# Altium schematic sheet STM32F407VGT6TR 100P MCU.SchDoc
size 381 x 254 mm
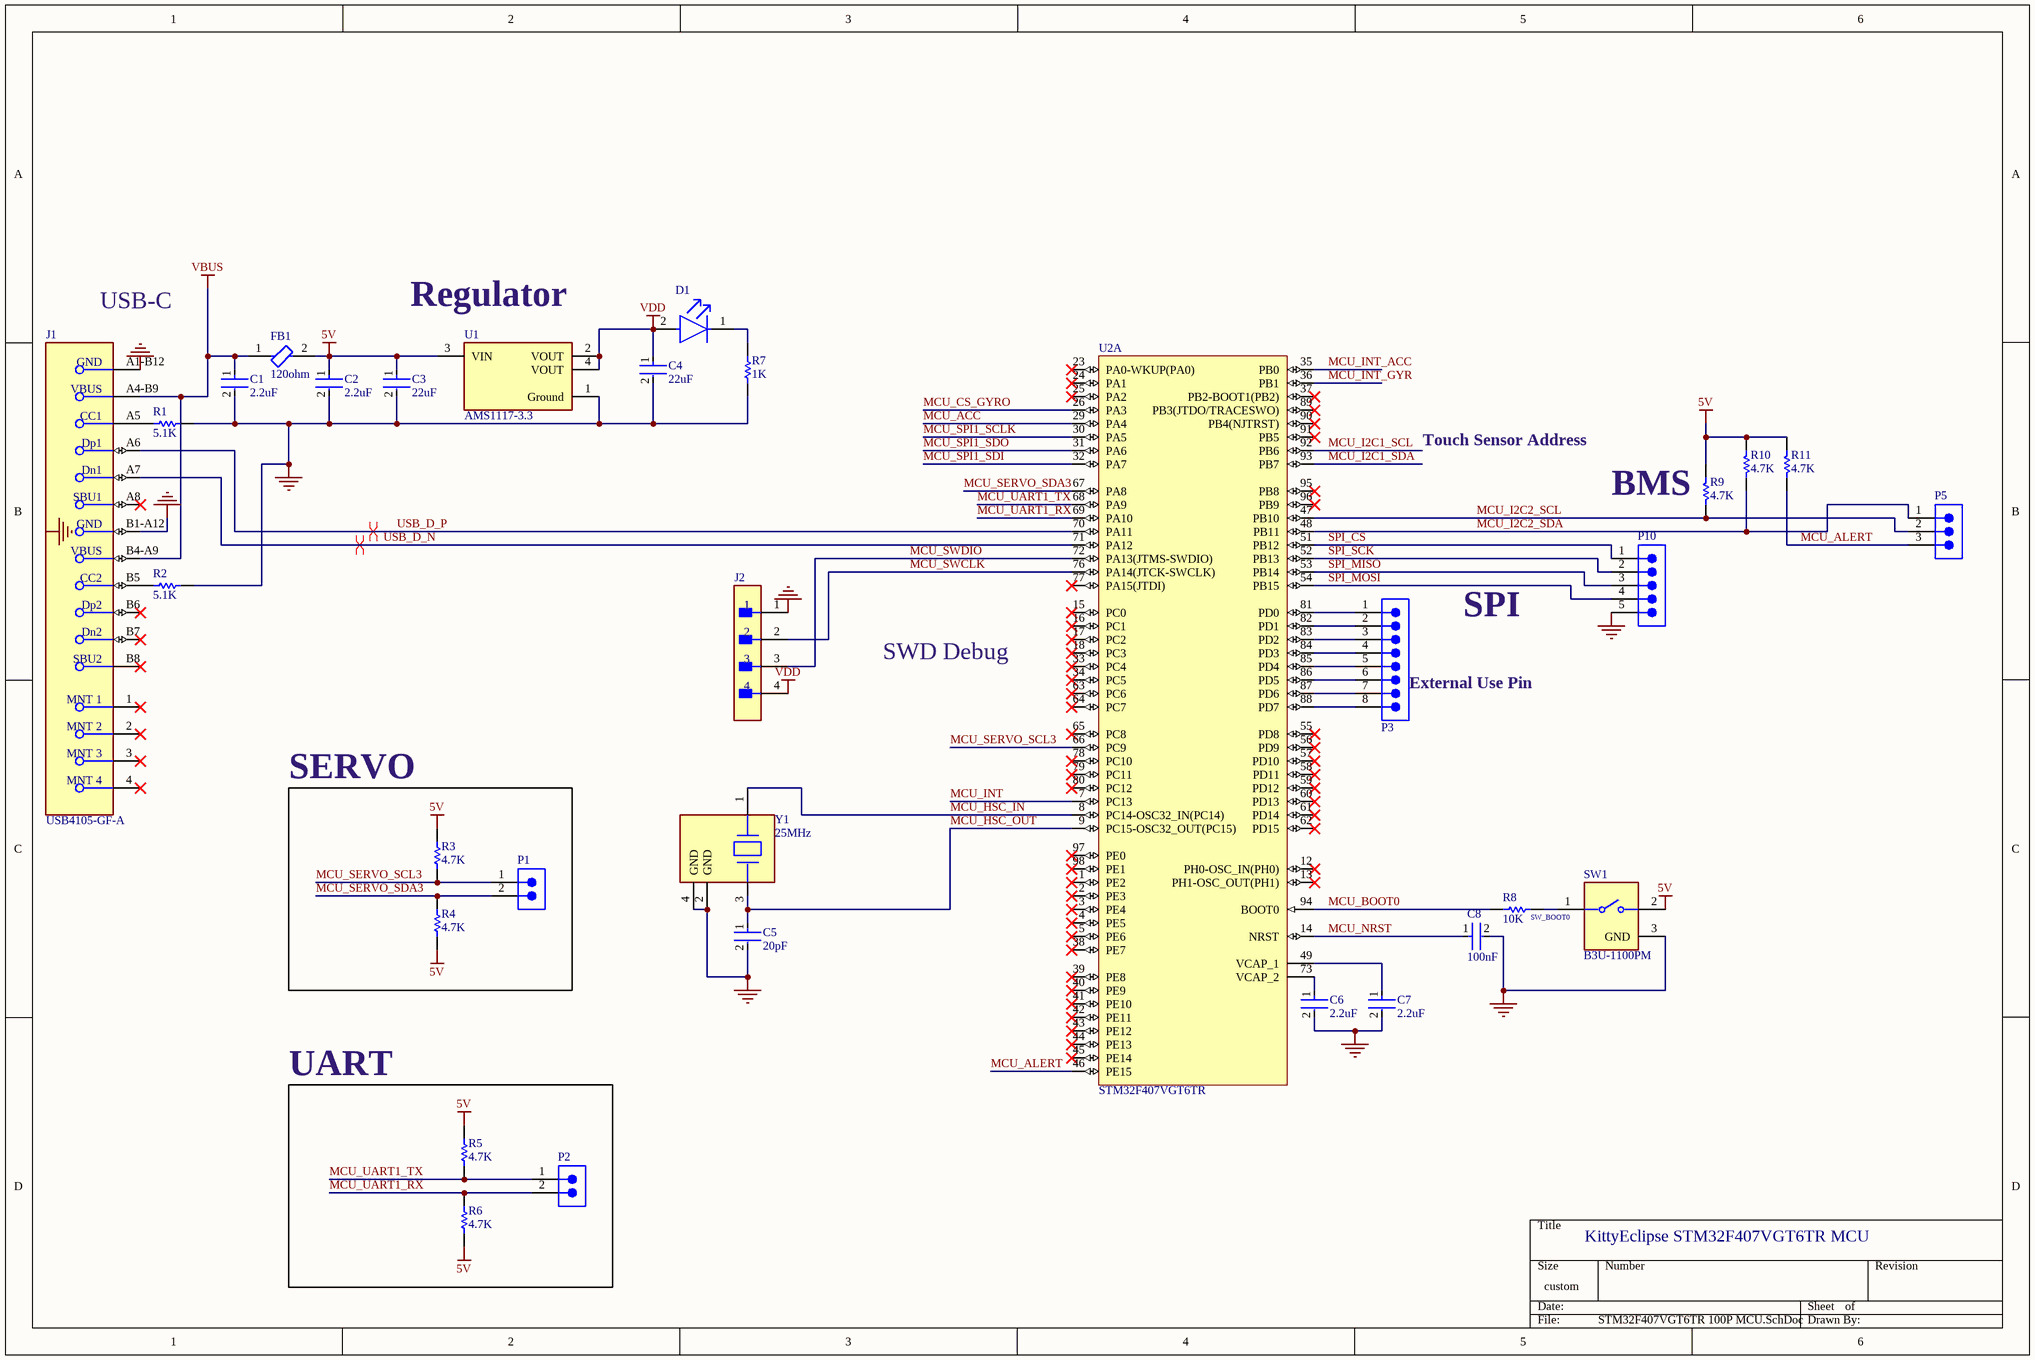
[diagram p0: STM32F407VGT6TR 100P MCU.SchDoc]

## Parts
C1  2.2uF  [FP-CL10-IPC_A]
C2  2.2uF  [FP-CL10-IPC_A]
C3  22uF  [FP-CL21-IPC_A]
C4  22uF  [FP-CL21-IPC_A]
C5  20pF  [FP-GCM155-0_05-IPC_A]
C6  2.2uF  [FP-CL10-IPC_A]
C7  2.2uF  [FP-CL10-IPC_A]
C8  100nF  [FP-CL93-IPC_C]
D1  LTST-C190GKT  [FP-LTST-C190GKT-MFG]  (value not drawn)
FB1  120ohm  [FP-MPZ1608-0_8-IPC_C]
J1  USB4105-GF-A  [FP-USB4105-GF-A-MFG]
J2  B4B-ZR(LF)(SN)  [FP-B4B-ZR_LF_SN-MFG]  (value not drawn)
P1  61300211121  [61300211121]  (value not drawn)
P2  61300211121  [61300211121]  (value not drawn)
P3  61300811121  [61300811121]  (value not drawn)
P5  61300311121  [61300311121]  (value not drawn)
P10  61300511121  [61300511121]  (value not drawn)
R1  5.1K  [RESC1005X40X25NL10T10]
R2  5.1K  [RESC1005X40X25NL10T10]
R3  4.7K  [RESC1608X55X25LL10T15]
R4  4.7K  [RESC1608X55X25LL10T15]
R5  4.7K  [RESC1608X55X25LL10T15]
R6  4.7K  [RESC1608X55X25LL10T15]
R7  1K  [RESC1608X55X30LL15T15]
R8  10K  [RESC1608X55X25ML10T15]
R9  4.7K  [RESC1608X55X25LL10T15]
R10  4.7K  [RESC1608X55X25LL10T15]
R11  4.7K  [RESC1608X55X25LL10T15]
SW1  B3U-1100PM  [FP-B3U-1100PM-MFG]
U1  AMS1117-3.3  [FP-AMS1117-IPC_C]
U2  STM32F407VGT6TR  [STM-LQFP100_L]  (part A of 2)
Y1  25MHz  [FP-ABM11W-MFG]

## Blocks framed on the sheet
SERVO: P1 R3 R4
UART: P2 R5 R6

## Nets
5V: C2.1 C3.1 FB1.2 R3.2 R4.1 R5.1 R6.1 R9.1 R10.1 R11.1 SW1.2 U1.3(VIN)
GND: C1.2 C2.2 C3.2 C4.2 C5.2 C6.2 C7.2 C8.2 J1.A1-B12(GND) J1.B1-A12(GND) J2.1 P10.5 R1.2 R2.2 R7.2 SW1.3(GND) U1.1(Ground) Y1.2(GND) Y1.4(GND)
VBUS: C1.1 FB1.1 J1.A4-B9(VBUS) J1.B4-A9(VBUS)
VDD: C4.1 D1.2(A) J2.4 U1.2(VOUT) U1.4(VOUT)
MCU_ACC: U2.29(PA4)
MCU_ALERT: P5.3 R11.2 U2.46(PE15)
MCU_BOOT0: R8.1 U2.94(BOOT0)
MCU_CS_GYRO: U2.26(PA3)
MCU_HSC_IN: U2.8(PC14-OSC32_IN(PC14)) Y1.1
MCU_HSC_OUT: C5.1 U2.9(PC15-OSC32_OUT(PC15)) Y1.3
MCU_I2C1_SCL: U2.92(PB6)
MCU_I2C1_SDA: U2.93(PB7)
MCU_I2C2_SCL: P5.2 R9.2 U2.47(PB10)
MCU_I2C2_SDA: P5.1 R10.2 U2.48(PB11)
MCU_INT: U2.7(PC13)
MCU_INT_ACC: U2.35(PB0)
MCU_INT_GYR: U2.36(PB1)
MCU_NRST: C8.1 U2.14(NRST)
MCU_SERVO_SCL3: P1.1 R3.1 U2.66(PC9)
MCU_SERVO_SDA3: P1.2 R4.2 U2.67(PA8)
MCU_SPI1_SCLK: U2.30(PA5)
MCU_SPI1_SDI: U2.32(PA7)
MCU_SPI1_SDO: U2.31(PA6)
MCU_SWCLK: J2.2 U2.76(PA14(JTCK-SWCLK))
MCU_SWDIO: J2.3 U2.72(PA13(JTMS-SWDIO))
MCU_UART1_RX: P2.2 R6.2 U2.69(PA10)
MCU_UART1_TX: P2.1 R5.2 U2.68(PA9)
SPI_CS: P10.1 U2.51(PB12)
SPI_MISO: P10.3 U2.53(PB14)
SPI_MOSI: P10.4 U2.54(PB15)
SPI_SCK: P10.2 U2.52(PB13)
USB_D_N: J1.A7(Dn1) U2.71(PA12)
USB_D_P: J1.A6(Dp1) U2.70(PA11)
NetC6_1: C6.1 U2.73(VCAP_2)
NetC7_1: C7.1 U2.49(VCAP_1)
NetD1_1: D1.1(C) R7.1
NetJ1_A5: J1.A5(CC1) R1.1
NetJ1_B5: J1.B5(CC2) R2.1
NetP3_1: P3.1 U2.81(PD0)
NetP3_2: P3.2 U2.82(PD1)
NetP3_3: P3.3 U2.83(PD2)
NetP3_4: P3.4 U2.84(PD3)
NetP3_5: P3.5 U2.85(PD4)
NetP3_6: P3.6 U2.86(PD5)
NetP3_7: P3.7 U2.87(PD6)
NetP3_8: P3.8 U2.88(PD7)
NetR8_2: R8.2 SW1.1

Not connected (* = marked no-connect by the designer): J1 1(MNT_1)* 2(MNT_2)* 3(MNT_3)* 4(MNT_4)* A8(SBU1)* B6(Dp2)* B7(Dn2)* B8(SBU2)*; U2 1(PE2)* 2(PE3)* 3(PE4)* 4(PE5)* 5(PE6)* 12(PH0-OSC_IN(PH0))* 13(PH1-OSC_OUT(PH1))* 15(PC0)* 16(PC1)* 17(PC2)* 18(PC3)* 23(PA0-WKUP(PA0))* 24(PA1)* 25(PA2)* 33(PC4)* 34(PC5)* 37(PB2-BOOT1(PB2))* 38(PE7)* 39(PE8)* 40(PE9)* 41(PE10)* 42(PE11)* 43(PE12)* 44(PE13)* 45(PE14)* 55(PD8)* 56(PD9)* 57(PD10)* 58(PD11)* 59(PD12)* 60(PD13)* 61(PD14)* 62(PD15)* 63(PC6)* 64(PC7)* 65(PC8)* 77(PA15(JTDI))* 78(PC10)* 79(PC11)* 80(PC12)* 89(PB3(JTDO/TRACESWO))* 90(PB4(NJTRST))* 91(PB5)* 95(PB8)* 96(PB9)* 97(PE0)* 98(PE1)*

## Layout directives
differential pair: USB_D_N, USB_D_P

## Notes on the sheet
- USB-C
- (near U1) Regulator
- Touch Sensor Address
- BMS
- SPI
- SWD Debug
- (near P3) External Use Pin
- (near R8) SW_BOOT0
- KittyEclipse STM32F407VGT6TR MCU
- Labels drawn without touching a wire or pin: GND

## Library data of the parts
C1 C2 C6 C7 = CMP-13271-000835-1: Cap Ceramic 2.2uF 16V X5R ±10% Pad SMD 0603 +85°C T/R; Case Code (Metric): 1608; Height: 0.8mm; Case/Package: 0603; Depth: 0.8mm; Capacitance: 2.2uF; Voltage Rating: 16V; Case Code (Imperial): 0603; Length: 1.6mm; Packaging: Tape and Reel; Material: Ceramic; Lead Free: Lead Free; Max Operating Temperature: 85°C; Contact Plating: Tin; Thickness: 0.035inch; Radiation Hardening: No; Tolerance: 10%; Min Operating Temperature: -55°C; Voltage: 16V; Dielectric: X5R; Mount: Surface Mount; Package Quantity: 4000; Width: 0.031inch; Voltage Rating (DC): 16V
C3 C4 = CMP-13271-000185-1: CL21 Series 0805 22uF 6.3V ±20% Tolerance X5R Multilayer Ceramic Chip Capacitor; Height: 1.25mm; Length: 2mm; Capacitance: 22uF; Mount: Surface Mount; Dielectric: X5R; Voltage Rating (DC): 6.3V; Case Code (Metric): 2012; Depth: 1.25mm; Max Operating Temperature: 85°C; Voltage Rating: 6.3V; Width: 0.049inch; Case/Package: 0805; Radiation Hardening: No; Thickness: 0.055inch; Packaging: Tape and Reel; Package Quantity: 2000; Lead Free: Lead Free; Contact Plating: Tin; Min Operating Temperature: -55°C; Case Code (Imperial): 0805; Tolerance: 20%
C5 = CMP-2008-03702-3: Ceramic Capacitor for Automotive 220pF ±5% 50VDC C0G 0402 Paper T/R; Temperature Coefficient: 30ppm/°C; Voltage Rating (DC): 50V; Thickness: 0.022inch; REACH SVHC: No SVHC; Termination: SMD/SMT; Radiation Hardening: No; Max Operating Temperature: 125°C; Mount: Surface Mount; Package Quantity: 1; Dielectric: C0G; Height: 0.5mm; Case Code (Imperial): 0402; Lead Free: Lead Free; Voltage Rating: 50V; Capacitance: 220pF; Case Code (Metric): 1005; Min Operating Temperature: -55°C; Case/Package: 0402; Packaging: Tape and Reel; Voltage: 50V; Ratings: AEC-Q200; Depth: 0.5mm; Length: 1mm; Tolerance: 5%; Width: 0.02inch
C8 = CMP-13271-000610-1: Cap Ceramic 100nF 10V X7R ±10% SMD 0402 +125°C Paper T/R
D1 = CMP-22017-000005-2: LED GREEN CLEAR CHIP SMD; Dominant Wavelength: 569nm; Reverse Voltage: 5V; Lens Color: Colorless; Viewing Angle: 130°; Voltage: 2V; Forward Current: 30mA; Power Dissipation: 100mW; Luminous Intensity: 6mcd; Number of LEDs: 1; Forward Voltage: 2.1V; Wavelength: 565nm; Test Current: 10mA; Min Operating Temperature: -55°C; Lens Style: Clear; Mount: Surface Mount; Width: 0.8mm; Packaging: Tape and Reel; Lens Transparency: Clear; Case Code (Metric): 1608; Depth: 0.8mm; Case Code (Imperial): 0603; Case/Package: 0603; Number of Pins: 2; Max Operating Temperature: 85°C; Lead Free: Lead Free; Number of Elements: 1; Length: 1.6mm; Height: 0.8mm; Package Quantity: 1; Power Rating: 100mW; Radiation Hardening: No; Illumination Color: Green; Color: Green
FB1 = CMP-08257-000448-1: Power line Ferrite Bead 390Ω @ 100MHz 1.2A DCR 0.12Ω SMD 0603; Tolerance: 25%; DC Resistance (DCR): 120mR; Impedance: 390R; Current Rating: 1.2A; RoHS Compliant: Yes; Lead Free: Lead Free; Number of Pins: 2; Case/Package: 0603; Mount: Surface Mount; Packaging: Tape and Reel; Case Code (Imperial): 0603; Core Material: Ferrite; Width: 0.031inch; Length: 0.063inch; Package Quantity: 4000; Height: 0.037inch; Case Code (Metric): 1608; Max DC Current: 1.2A; REACH SVHC: No SVHC; Series: MPZ
J1 = CMP-245163-000001-1: CONN RCPT USB2.0 TYPEC 5A; Manufacturer: GCT; Description: USB - C (Type - C) USB 2.0 Receptacle Connector 24 Position Surface Mount, Right Angle; Through Hole; Voltage Rating: 20V; Is Female: yes; Current Rating: 5/6.25/1.25/0.25A; Number Of Contacts: 16; Conn Orientation: Right Angle; Device Class L1: Connectors; Category: Conn; Lead Free: Yes; RoHS: TRUE; Temperature Range High: +85°C; Digikey Description: CONN RCPT USB2.0 TYPEC 5A; Device Class L3: unset; ComponentLink2Description: Datasheet; Manufacturer Part Number: USB4105-GF-A; Package: 0; Usb Standard: USB 2.0; Device Class L2: USB Connectors; Automotive: No; Temperature Range Low: -40°C; Height: 3.46mm; Temperature: -40°C to +85°C; Contact Material: Gold,Nickel; ComponentLink2URL: https://gct.co/files/drawings/usb4105.pdf; Octopart: https://octopart.com/usb4105-gf-a-gct-106627878
J2 = CMP-17439-000033-1: CONN HEADER VERT 4POS 1.5MM; Max Current Rating: 1A; Max Voltage Rating (AC): 50V; Contact Resistance: 30mR; Body Plating: Tin; Number of Positions: 4; Connector Type: Male Pin; Panel Thickness: 3.5mm; Gender: Male; Insulation Resistance: 500MR; Termination: Solder; Fastening Type: Detent; Housing Material: Polyamide; Voltage Rating (DC): 50V; REACH SVHC: No SVHC; Lead Free: Lead Free; Min Operating Temperature: -25°C; Depth: 3.5mm; Contact Mating Length: 0.094inch; Material: Nylon; Max Operating Temperature: 85°C; Mount: Through Hole; Number of Rows: 1; Orientation: Straight; Current Rating: 1A; Flammability Rating: UL94 V-0; Housing Color: Beige; Length: 7.5mm; Packaging: Bulk; Voltage Rating: 50V; Voltage Rating (AC): 50V; Number of Contacts: 4; Lead Pitch: 1.5mm; Series: ZH; Color: Natural; Contact Plating: Tin; Pitch: 1.5mm; Contact Type: Male Pin; Contact Material: Brass
P1 P2 = CMP-1712-00002-6: NexarPartId: 20081794; Number of Contacts: 2; Pitch: 2.54mm; Connector Type: Male Pin; Voltage Rating: 250V; Current Rating: 3A; Gender: Male; Contact Resistance: 20mΩ; Height: 8.94mm; Lead Free: Lead Free; Number of Pins: 2; Termination: Through Hole; RoHS: Compliant; Lead Pitch: 2.54mm; REACH SVHC: No SVHC; Housing Material: PBT; Contact Mating Length: 5.9944mm; Min Operating Temperature: -40°C; Orientation: Vertical; Contact Material: Copper; Contact Gender: Male; Max Operating Temperature: 125°C; Number of Rows: 1; Number of Positions: 2; Packaging: Bulk; Contact Plating: Gold; Mount: Through Hole; Color: Black; Operating Supply Voltage: 250V
P3 = CMP-1502-01076-3: NexarPartId: 32855533; Connector Type: Male Pin; Number of Contacts: 8; Voltage Rating: 250V; Current Rating: 3A; Contact Resistance: 20mΩ; Pitch: 2.54mm; Gender: Male; Termination: Solder; Contact Material: Copper; Mount: Through Hole; Lead Pitch: 2.54mm; Number of Positions: 8; Operating Supply Voltage: 250V; Number of Pins: 8; Max Operating Temperature: 105°C; Height: 8.54mm; REACH SVHC: Unknown; Number of Rows: 1; Packaging: Bulk; Contact Plating: Gold; Contact Mating Length: 5.9944mm; Orientation: Vertical; RoHS: Compliant; Color: Black; Min Operating Temperature: -40°C
P5 = CMP-1502-01062-3: NexarPartId: 32855521; Current Rating: 3A; Voltage Rating: 250V; Number of Positions: 3; Pitch: 2.54mm; Contact Resistance: 20mΩ; Connector Type: Male Pin; Gender: Male; REACH SVHC: Unknown; Packaging: Bulk; Contact Material: Copper; Min Operating Temperature: -40°C; Number of Rows: 1; Orientation: Vertical; RoHS: Compliant; Contact Plating: Gold; Max Operating Temperature: 105°C; Mount: Through Hole; Height: 8.94mm; Operating Supply Voltage: 250V; Number of Pins: 3; Contact Mating Length: 5.9944mm; Number of Contacts: 3; Color: Black; Lead Free: Lead Free; Lead Pitch: 2.54mm; Termination: Solder
P10 = CMP-1502-01068-3: NexarPartId: 32855526; Connector Type: Male Pin; Gender: Male; Contact Resistance: 20mΩ; Pitch: 2.54mm; Operating Supply Voltage: 250V; Current Rating: 3A; Number of Contacts: 5; Lead Free: Lead Free; Color: Black; Packaging: Bulk; Lead Pitch: 2.54mm; Contact Material: Copper; Min Operating Temperature: -40°C; Contact Mating Length: 5.9944mm; Voltage Rating: 250V; Number of Pins: 5; Number of Positions: 5; Height: 8.89mm; Orientation: Vertical; REACH SVHC: Unknown; RoHS: Compliant; Contact Plating: Gold; Max Operating Temperature: 105°C; Mount: Through Hole; Number of Rows: 1; Termination: Solder
R1 R2 = CMP-2002-05812-1: Manufacturer: Panasonic; Part Number: ERA-2AEB512X
R3-R6 R9-R11 = CMP-2000-06942-1: Chip Resistor, 4.7 KOhm, +/- 1%, 0.1 W, -55 to 155 degC, 0603 (1608 Metric), RoHS, Tape and Reel; Manufacturer: Yageo; Power Rating: 100mW; Temperature Coefficient: 100PPM/C; Resistance: 4.7kOhms; Voltage Rating: 50V; Package Reference: 0603; Series: RC; Datasheet Version: Rev. 7, 05/2017; Packaging: Reel; Termination Style: SMD/SMT; Datasheet URL: http://www.yageo.com/documents/recent/PYu-RC_Group_51_RoHS_L_7.pdf; Manufacturer URL: http://www.yageo.com/; Package Description: 2-Pin Surface Mount Device, Body 1.6 x 0.8 mm; Case Code - mm: 1608; Case Code - in: 0603; Mounting Technology: SurfaceMount; Operating Temperature Range: -55Cto+155C; Tolerance: 1%; Product: ThickFilmResistorsGeneralPurpose
R7 = CMP-2000-00180-1: Part Number: ERJ-3EKF1001V; Manufacturer: Panasonic
R8 = CMP-2000-05022-1: Resistor, 10 KOhm, +/- 5%, 100 mW, -55 to 155 degC, 0603 (1608 Metric), RoHS, Tape and Reel; Manufacturer: Yageo; Resistance: 10kOhms; Voltage Rating: 50V; Temperature Coefficient: 100PPM/C; Power Rating: 100mW; Package Reference: 603; Series: RC; Case Code - mm: 1608; Packaging: Reel; Datasheet URL: http://www.farnell.com/datasheets/443971.pdf; Datasheet Version: Rev. 4, 04/2009; Operating Temperature Range: -55Cto+155C; Product: ThickFilmResistorsGeneralPurpose; Package Description: 2-Pin Surface Mount Device, Body 1.6 x 0.8 mm; Manufacturer URL: http://www.yageo.com/; Case Code - in: 0603; Tolerance: 5%; Termination Style: SMD/SMT
SW1 = CMP-08834-000028-1: SWITCH TACTILE SPST-NO 0.05A 12V; Switch Travel: 0.15mm; Throw Configuration: SPST; Current Rating: 50mA; Illumination Type: Non-Illuminated; Actuator Length: 0.4mm; Operating Force: 1.5N; Connector Type: SMD/SMT; Contact Resistance: 100mR; Actuator Type: Standard; Electrical Life: 200000Cycles; Switch Function: Off-Mom; Ratings: Dust Proof; Max Operating Temperature: 70°C; Weight: 0.022g; Series: B3U; Min Operating Temperature: -25°C; Voltage Rating (DC): 12V; Orientation: Straight; Package Quantity: 1000; Packaging: Tape and Reel; RoHS Compliant: Yes; REACH SVHC: No SVHC; Max Voltage Rating (DC): 12V; Mount: Surface Mount; Case/Package: SMD/SMT; Mechanical Life: 200000Cycles; Termination: SMD/SMT
U1 = CMP-209535-000001-1: LDO Voltage Regulators 1A, 3.3V; Manufacturer: Advanced Monolithic Systems; Dropout Voltage: 1.1V; Output Type: Fixed; Nominal Supply Current: 5mA; Max Power Dissipation: 1.2W; Max Supply Voltage: 15V; Number Of Outputs: 1; Standoff Height: 0.64mm; Max Junction Temp: +125°C; Height: 1.8mm; Package: AMS1117; Device Class L2: Power Management ICs; ComponentLink2Description: Datasheet; ComponentLink2URL: http://www.advanced-monolithic.com/pdf/ds1117.pdf; Category: IC; RoHS: TRUE; Automotive: No; Device Class L1: Integrated Circuits (ICs); Output Current: 1A; Device Class L3: Voltage Regulators - Linear; Temperature: -40°C to +125°C; Output Voltage: 3.3V; Manufacturer Part Number: AMS1117-3.3; Temperature Range Low: -40°C; Octopart: https://octopart.com/ams1117-3.3-advanced+monolithic+systems-25899300; Lead Free: Yes; Ipc Land Pattern Name: SOT229P700X180-4; Temperature Range High: +125°C
U2 = CMP-0243-00033-2: ARM Cortex-M4 32-bit MCU+FPU, 210 DMIPS, 1024 kB Flash, 192 kB Internal RAM, 82 I/Os, 100-pin LQFP, -40 to 85 degC, Tape and Reel; Manufacturer: STMicroelectronics; Supply Voltage(Vcc) max (V): 3.6; Supply Voltage(Vcc) min (V): 1.8; D/A Converter: 2x12-bit; I/Os (High Current): 82; Operating Frequency(F) (Processor speed) (MHz): 168; FLASH Size (Prog) (kB): 1024; Internal RAM Size (kB): 192; ComponentLink1Description: Manufacturer URL; PackageDescription: 100-Pin Low Profile Quad Flat Package, 14 x 14 mm Body, 0.5 mm Pitch; DatasheetVersion: Rev. 4; ComponentLink1URL: http://www.st.com/web/en/home.html; Mounting Technology: Surface Mount; ComponentLink3URL: http://www.st.com/st-web-ui/static/active/en/resource/technical/document/data_brief/DM00071938.pdf; PartNumber: STM32F407VGT6TR; ComponentLink2URL: http://www.st.com/st-web-ui/static/active/en/resource/technical/document/datasheet/DM00037051.pdf; Packing: Tape and Reel; ComponentLink2Description: Datasheet; PackageReference: LQFP100; ComponentLink3Description: Package Specification; PackageVersion: Rev. 1, 06/2013; Core: ARM Cortex-M4
Y1 = CMP-27762-002822-1: Crystal 25MHz ±10ppm 8pF SMD-4 2mm x 1.6mm